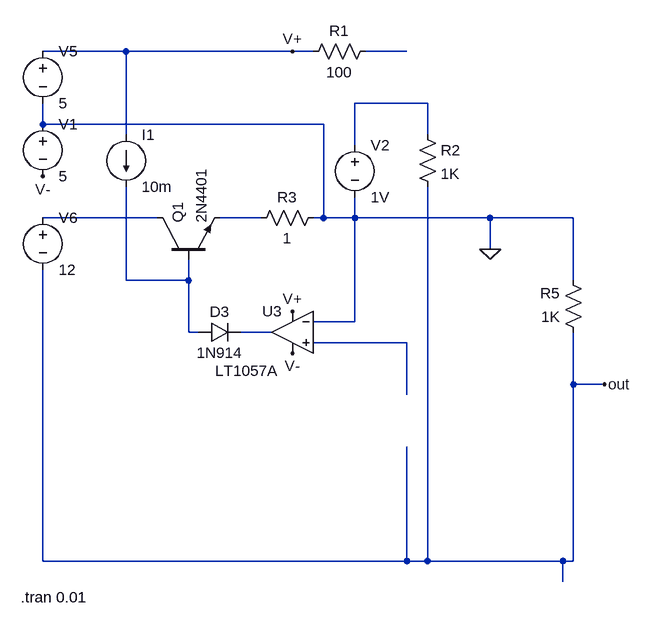
[diagram p0: schematic microcurrent_source.asc]
microcurrent_source.asc, the LTspice schematic file:
Version 4
SHEET 1 2392 680
WIRE 1600 -464 1472 -464
WIRE 1856 -464 1600 -464
WIRE 1888 -464 1856 -464
WIRE 2032 -464 1968 -464
WIRE 2064 -384 1952 -384
WIRE 1472 -352 1472 -384
WIRE 1904 -352 1472 -352
WIRE 1600 -336 1600 -464
WIRE 2064 -336 2064 -384
WIRE 1952 -320 1952 -384
WIRE 1648 -208 1472 -208
WIRE 1808 -208 1744 -208
WIRE 1904 -208 1904 -352
WIRE 1904 -208 1888 -208
WIRE 1952 -208 1952 -240
WIRE 1952 -208 1904 -208
WIRE 2160 -208 1952 -208
WIRE 2288 -208 2160 -208
WIRE 2160 -160 2160 -208
WIRE 1600 -112 1600 -256
WIRE 1696 -112 1696 -144
WIRE 1696 -112 1600 -112
WIRE 2288 -112 2288 -208
WIRE 1952 -48 1952 -208
WIRE 1952 -48 1888 -48
WIRE 1696 -32 1696 -112
WIRE 1712 -32 1696 -32
WIRE 1824 -32 1776 -32
WIRE 2032 -16 1888 -16
WIRE 2288 48 2288 -32
WIRE 2336 48 2288 48
WIRE 2032 64 2032 -16
WIRE 1472 320 1472 -128
WIRE 2032 320 2032 144
WIRE 2032 320 1472 320
WIRE 2064 320 2064 -256
WIRE 2064 320 2032 320
WIRE 2272 320 2064 320
WIRE 2288 320 2288 48
WIRE 2288 320 2272 320
WIRE 2272 352 2272 320
FLAG 1856 -64 V+
FLAG 1856 -464 V+
FLAG 1856 0 V-
FLAG 1472 -272 V-
FLAG 2160 -160 0
FLAG 2336 48 out
SYMBOL voltage 1472 -480 R0
WINDOW 123 0 0 Left 0
WINDOW 39 0 0 Left 0
SYMATTR InstName V5
SYMATTR Value 5
SYMBOL voltage 1472 -224 R0
WINDOW 123 0 0 Left 0
WINDOW 39 0 0 Left 0
SYMATTR InstName V6
SYMATTR Value 12
SYMBOL Opamps\\LT1057A 1856 -96 M0
WINDOW 3 21 123 Left 2
SYMATTR InstName U3
SYMBOL res 1904 -224 R90
WINDOW 0 0 56 VBottom 2
WINDOW 3 32 56 VTop 2
SYMATTR InstName R3
SYMATTR Value 1
SYMBOL res 2304 -16 R180
WINDOW 0 36 76 Left 2
WINDOW 3 36 40 Left 2
SYMATTR InstName R5
SYMATTR Value 1K
SYMBOL npn 1648 -144 R270
SYMATTR InstName Q1
SYMATTR Value 2N4401
SYMBOL diode 1712 -16 R270
WINDOW 0 32 32 VTop 2
WINDOW 3 0 32 VBottom 2
SYMATTR InstName D3
SYMATTR Value 1N914
SYMBOL voltage 1472 -368 R0
WINDOW 123 0 0 Left 0
WINDOW 39 0 0 Left 0
SYMATTR InstName V1
SYMATTR Value 5
SYMBOL current 1600 -336 R0
WINDOW 123 0 0 Left 0
WINDOW 39 0 0 Left 0
SYMATTR InstName I1
SYMATTR Value 10m
SYMBOL voltage 1952 -336 R0
WINDOW 123 0 0 Left 0
WINDOW 39 0 0 Left 0
SYMATTR InstName V2
SYMATTR Value 1V
SYMBOL res 1984 -480 R90
WINDOW 0 0 56 VBottom 2
WINDOW 3 32 56 VTop 2
SYMATTR InstName R1
SYMATTR Value 100
SYMBOL res 2048 -352 R0
SYMATTR InstName R2
SYMATTR Value 1K
TEXT 1438 376 Left 2 !.tran 0.01

The netlist it stands for:
* microcurrent_source.asc
V5 V+ 0 5
V6 N003 out 12
XU3 N007 0 V+ V- N006 LT1057A  ; pins In+ In- V+ V- OUT
R3 0 N004 1
R5 out 0 1K
Q1 N003 N005 N004 0 2N4401
D3 N005 N006 1N914
V1 0 V- 5
I1 V+ N005 10m
V2 N002 0 1V
R1 N001 V+ 100
R2 N002 out 1K
.model D D
.lib standard.dio
.model NPN NPN
.model PNP PNP
.lib standard.bjt
.tran 0.01
.backanno
.end